# EAGLE design PIC32try2 (EAGLE 5.12)
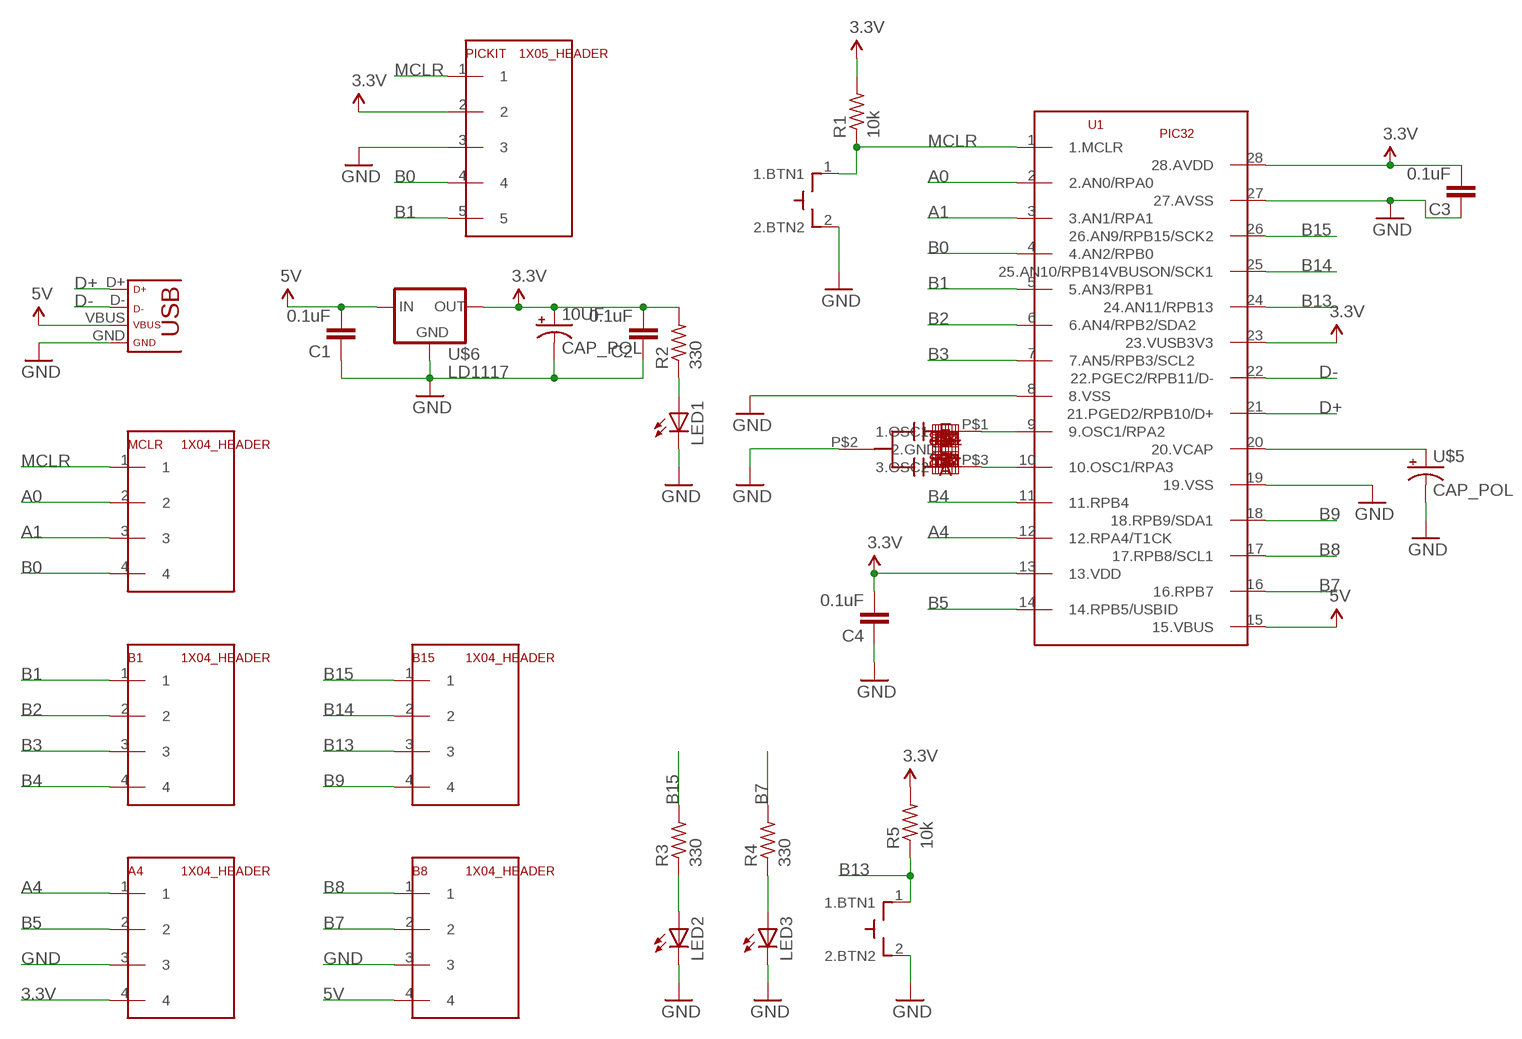
[diagram p0: schematic, sheet 1]

## Parts
8MHZ  CRYST2CRYST3  [CRYST2]
10UF  CAP_POL  [CAP_POL_D]
A4  1X04_HEADER  [1X04]
B1  1X04_HEADER  [1X04]
B8  1X04_HEADER  [1X04]
B15  1X04_HEADER  [1X04]
C1  0.1uF  C-EU025-025X050  [C025-025X050]
C2  0.1uF  C-EU025-025X050  [C025-025X050]
C3  0.1uF  C-EU025-025X050  [C025-025X050]
C4  0.1uF  C-EU025-025X050  [C025-025X050]
LED1  LED3MM  [LED3MM]
LED2  LED3MM  [LED3MM]
LED3  LED3MM  [LED3MM]
MCLR  1X04_HEADER  [1X04]
PICKIT  1X05_HEADER  [1X05]
R1  10k  R-US_0207/10  [0207/10]
R2  330  R-US_0207/10  [0207/10]
R3  330  R-US_0207/10  [0207/10]
R4  330  R-US_0207/10  [0207/10]
R5  10k  R-US_0207/10  [0207/10]
U1  PIC32  [DIL28-3]
U$4  PUSHBUTTON  [PB]
U$5  CAP_POL  [CAP_POL_D]
U$6  LD1117  [TO220]
U$9  USB  [USB-MINIB]
U$16  PUSHBUTTON  [PB]

## Nets
3.3V: 10UF.1(+) A4.4 C2.2 C3.2 C4.2 PICKIT.2 R1.2 R2.2 R5.2 U1.13(13.VDD) U1.23(23.VUSB3V3) U1.28(28.AVDD) U$6.2(OUT)
5V: B8.4 C1.2 U1.15(15.VBUS) U$6.3(IN) U$9.VBUS
A0: MCLR.2 U1.2(2.AN0/RPA0)
A1: MCLR.3 U1.3(3.AN1/RPA1)
A4: A4.1 U1.12(12.RPA4/T1CK)
B0: MCLR.4 PICKIT.4 U1.4(4.AN2/RPB0)
B1: B1.1 PICKIT.5 U1.5(5.AN3/RPB1)
B2: B1.2 U1.6(6.AN4/RPB2/SDA2)
B3: B1.3 U1.7(7.AN5/RPB3/SCL2)
B4: B1.4 U1.11(11.RPB4)
B5: A4.2 U1.14(14.RPB5/USBID)
B7: B8.2 R4.2 U1.16(16.RPB7)
B8: B8.1 U1.17(17.RPB8/SCL1)
B9: B15.4 U1.18(18.RPB9/SDA1)
B13: B15.3 R5.1 U1.24(24.AN11/RPB13) U$16.1(1.BTN1)
B14: B15.2 U1.25(25.AN10/RPB14VBUSON/SCK1)
B15: B15.1 R3.2 U1.26(26.AN9/RPB15/SCK2)
D+: U1.21(21.PGED2/RPB10/D+) U$9.D+
D-: U1.22(22.PGEC2/RPB11/D-) U$9.D-
GND: 8MHZ.P$2(2.GND) 10UF.2(-) A4.3 B8.3 C1.1 C2.1 C3.1 C4.1 LED1.K(C) LED2.K(C) LED3.K(C) PICKIT.3 U1.8(8.VSS) U1.19(19.VSS) U1.27(27.AVSS) U$4.2(2.BTN2) U$5.2(-) U$6.1(GND) U$9.GND U$16.2(2.BTN2)
MCLR: MCLR.1 PICKIT.1 R1.1 U1.1(1.MCLR) U$4.1(1.BTN1)
N$1: LED1.A R2.1
N$2: LED2.A R3.1
N$3: LED3.A R4.1
N$4: 8MHZ.P$1(1.OSC1) U1.9(9.OSC1/RPA2)
N$5: 8MHZ.P$3(3.OSC2) U1.10(10.OSC1/RPA3)
N$23: U1.20(20.VCAP) U$5.1(+)

## Library data of the parts
8MHZ = ME433:CRYST2
10UF U$5 = ME433:CAP_POL
A4 B1 B8 B15 MCLR = ME433:1X04_HEADER
C1-C4 = ME433:C-EU: CAPACITOR, European symbol
LED1-LED3 = led:LED: LED OSRAM: - CHIPLED LG R971, LG N971, LY N971, LG Q971, LY Q971, LO R971, LY R971 LH N974, LH R974 LS Q976, LO Q976, LY Q976 LO Q996 - Hyper CHIPLED LW Q18S LB Q993, LB Q99A, LB R99A - SideLED LS A670, LO A670, LY A670, LG A670, LP A670 LB A673, LV A673, LT A673, LW A673 LH A674 LY A675 LS A676, LA A676, LO A676, LY A676, LW A676 LS A679, LY A679, LG A679 - Hyper Micro SIDELED® LS Y876, LA Y876, LO Y876, LY Y876 LT Y87S - SmartLED LW L88C, LW L88S LB L89C, LB L89S, LG L890 LS L89K, LO L89K, LY L89K LS L896, LA L896, LO L896, LY L896 - TOPLED LS T670, LO T670, LY T670, LG T670, LP T670 LSG T670, LSP T670, LSY T670, LOP T670, LYG T670 LG T671, LOG T671, LSG T671 LB T673, LV T673, LT T673, LW T673 LH T674 LS T676, LA T676, LO T676, LY T676, LB T676, LH T676, LSB T676, LW T676 LB T67C, LV T67C, LT T67C, LS T67K, LO T67K, LY T67K, LW E67C LS E67B, LA E67B, LO E67B, LY E67B, LB E67C, LV E67C, LT E67C LW T67C LS T679, LY T679, LG T679 LS T770, LO T770, LY T770, LG T770, LP T770 LB T773, LV T773, LT T773, LW T773 LH T774 LS E675, LA E675, LY E675, LS T675 LS T776, LA T776, LO T776, LY T776, LB T776 LHGB T686 LT T68C, LB T68C - Hyper Mini TOPLED® LB M676 - Mini TOPLED Santana® LG M470 LS M47K, LO M47K, LY M47K Source: http://www.osram.convergy.de LUXEON: - LUMILED® LXK2-PW12-R00, LXK2-PW12-S00, LXK2-PW14-U00, LXK2-PW14-V00 LXK2-PM12-R00, LXK2-PM12-S00, LXK2-PM14-U00 LXK2-PE12-Q00, LXK2-PE12-R00, LXK2-PE12-S00, LXK2-PE14-T00, LXK2-PE14-U00 LXK2-PB12-K00, LXK2-PB12-L00, LXK2-PB12-M00, LXK2-PB14-N00, LXK2-PB14-P00, LXK2-PB14-Q00 LXK2-PR12-L00, LXK2-PR12-M00, LXK2-PR14-Q00, LXK2-PR14-R00 LXK2-PD12-Q00, LXK2-PD12-R00, LXK2-PD12-S00 LXK2-PH12-R00, LXK2-PH12-S00 LXK2-PL12-P00, LXK2-PL12-Q00, LXK2-PL12-R00 Source: www.luxeon.com KINGBRIGHT: KA-3528ASYC Source: www.kingbright.com
PICKIT = ME433:1X05_HEADER
R1-R5 = resistor:R-US_: RESISTOR, American symbol
U1 = ME433:PIC32
U$4 U$16 = ME433:PUSHBUTTON
U$6 = ME433:LD1117
U$9 = ME433:USB

## Board
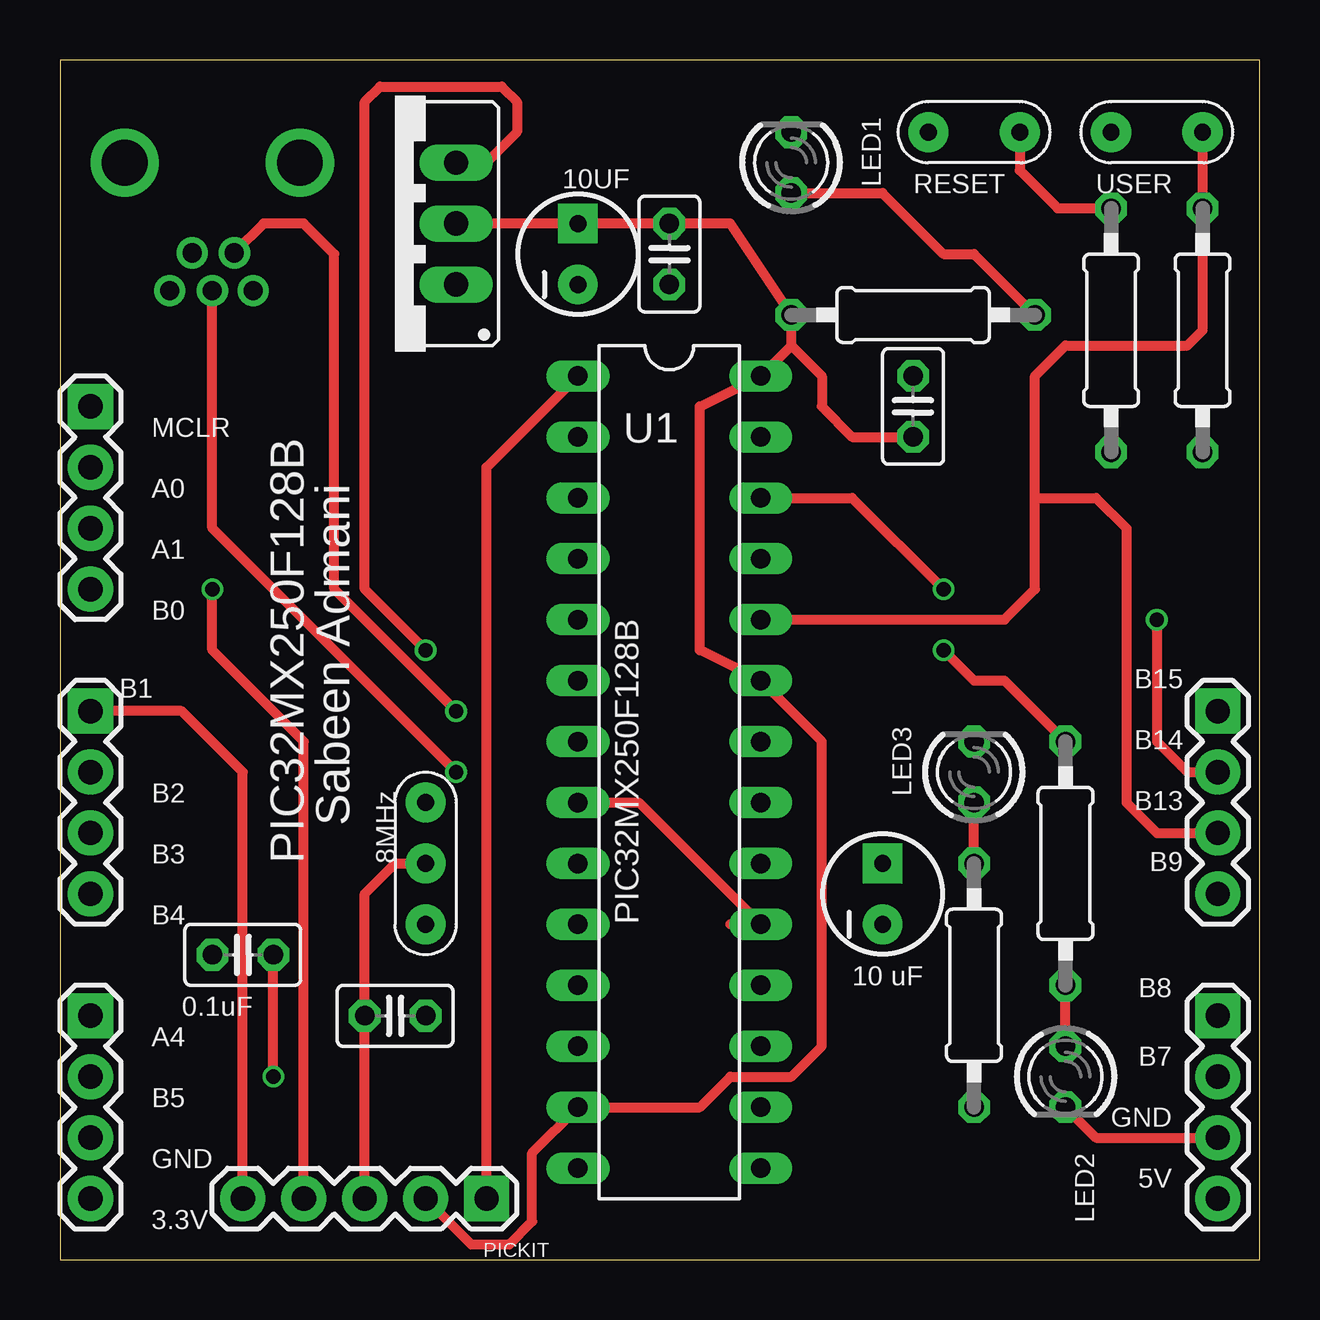
[diagram p1: board, top side]
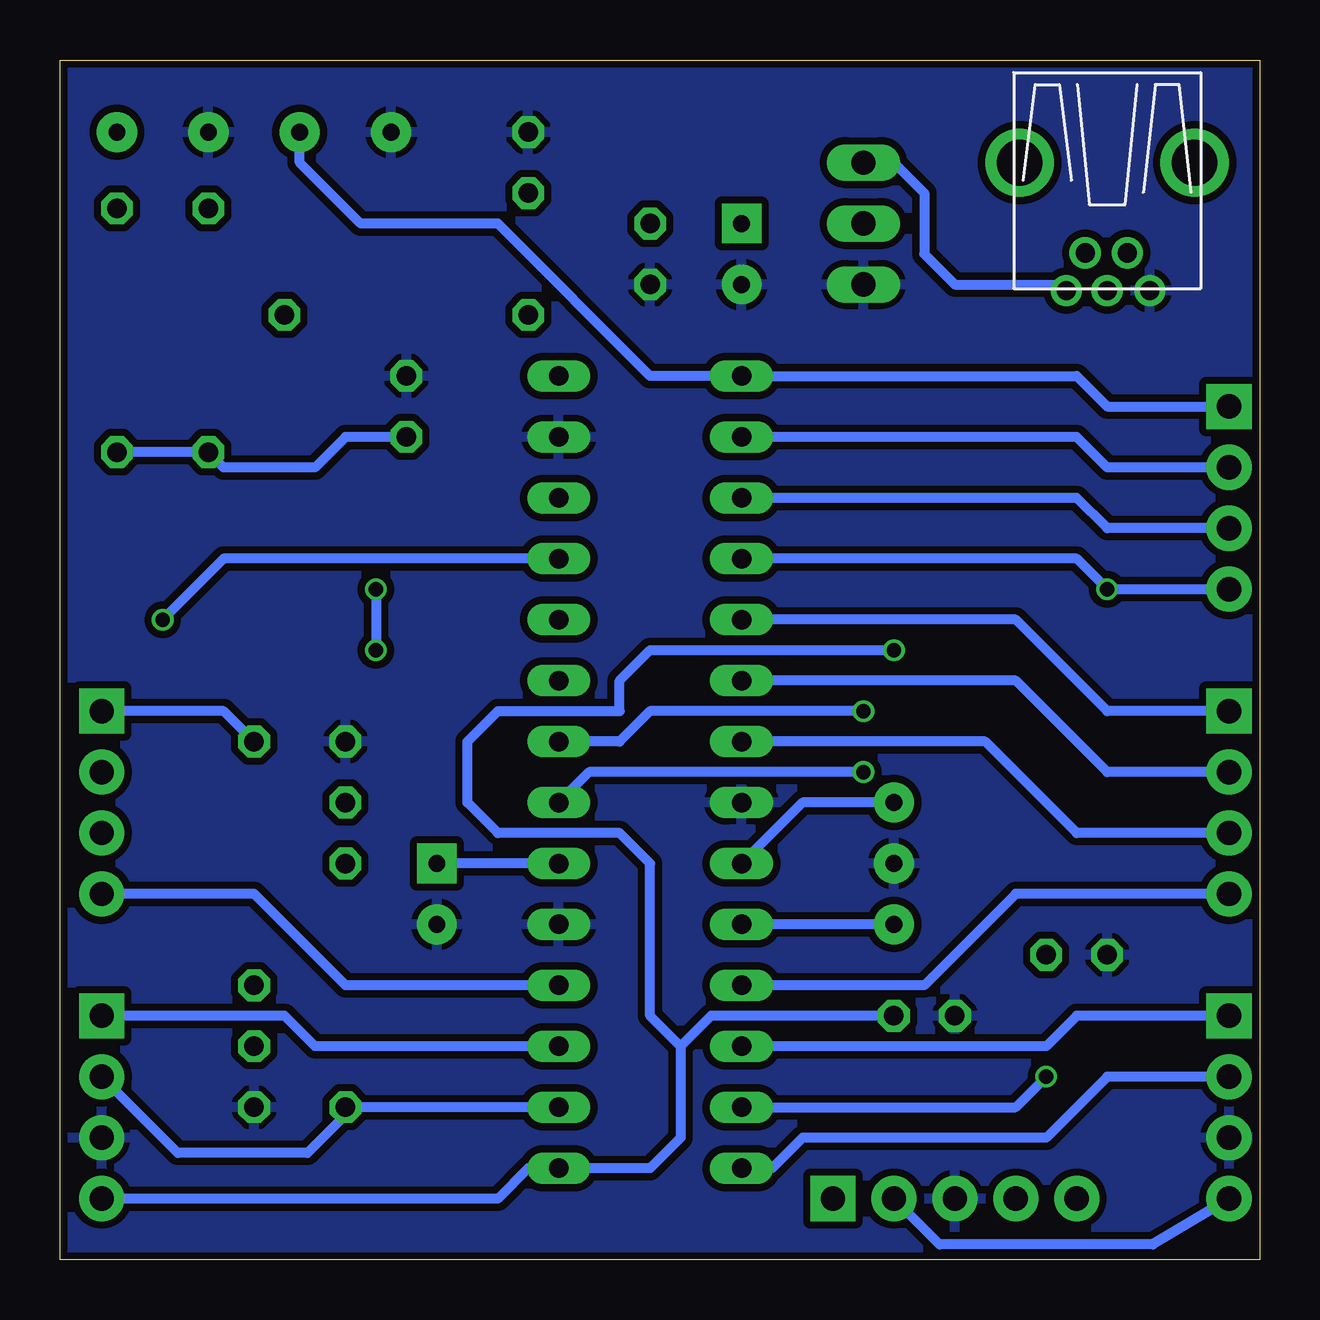
[diagram p2: board, bottom side, seen from below]

Size 50 x 50 mm. Coordinates in mm from the lower left corner, seen from the top.
Outline: 0,0 50,0 50,50 0,50 0,0
Copper layers (1*16): Top 0.035mm / dielectric 1.5mm / Bottom 0.035mm
Design rules "SeeedStudio_2layer_DRU_no_angle_20140221": minimum track width 6mil, minimum drill 12mil, track to track 6mil, track to pad 6mil, pad to pad 6mil, via to via 6mil, smd to smd 0mil, copper to edge 10mil, drill to drill 10mil, minimum pad ring 10mil, minimum via ring 6mil, stop-mask expansion 2mil, vias tented up to drill 100mil, thermal gap 10mil

### Footprints (pad centres in the part's own frame; a part is rotated, then mirrored left to right if it is on the bottom)
CRYST2 = drill 0.7 pad 1.676 round: P$1 -2.54,0; P$2 0,0; P$3 2.54,0
CAP_POL_D = drill 0.7 pad 1.651 square: 1 1.27,0 | drill 0.7 pad 1.651 round: 2 -1.27,0
1X04 = drill 1.016 pad 1.88 square: 1 0,0 | drill 1.016 pad 1.88 round: 2 2.54,0; 3 5.08,0; 4 7.62,0
C025-025X050 = drill 0.813 octagon: 1 -1.27,0; 2 1.27,0
LED3MM = drill 0.813 octagon: A -1.27,0; K 1.27,0
1X05 = drill 1.016 pad 1.88 square: 1 0,0 | drill 1.016 pad 1.88 round: 2 2.54,0; 3 5.08,0; 4 7.62,0; 5 10.16,0
0207/10 = drill 0.813 octagon: 1 -5.08,0; 2 5.08,0
DIL28-3 = drill 0.813 long: 1 -16.51,-3.81; 2 -13.97,-3.81; 3 -11.43,-3.81; 4 -8.89,-3.81; 5 -6.35,-3.81; 6 -3.81,-3.81; 7 -1.27,-3.81; 8 1.27,-3.81; 9 3.81,-3.81; 10 6.35,-3.81; 11 8.89,-3.81; 12 11.43,-3.81; 13 13.97,-3.81; 14 16.51,-3.81; 15 16.51,3.81; 16 13.97,3.81; 17 11.43,3.81; 18 8.89,3.81; 19 6.35,3.81; 20 3.81,3.81; 21 1.27,3.81; 22 -1.27,3.81; 23 -3.81,3.81; 24 -6.35,3.81; 25 -8.89,3.81; 26 -11.43,3.81; 27 -13.97,3.81; 28 -16.51,3.81
PB = drill 0.7 pad 1.676 round: 1 -1.905,0; 2 1.905,0
TO220 = drill 1.016 long: 1 -2.54,0; 2 0,0; 3 2.54,0
USB-MINIB = drill 0.8 round: D+ 4.064,0; D- 2.489,0.914; GND 4.064,-1.778; ID 2.489,-0.838; VBUS 4.064,1.702 | drill 1.9 round: P$6 -1.27,-3.65; P$7 -1.27,3.65

### Placement (x,y rotation side)
8MHZ  15.24,16.51 270 top
10UF  21.59,41.91 90 top
A4  1.27,10.16 270 top
B1  1.27,22.86 270 top
B8  48.26,10.16 270 top
B15  48.26,22.86 270 top
C1  13.97,10.16 0 top
C2  25.4,41.91 90 top
C3  35.56,35.56 270 top
C4  7.62,12.7 0 top
LED1  30.48,45.72 90 top
LED2  41.91,7.62 270 top
LED3  38.1,20.32 90 top
MCLR  1.27,35.56 270 top
PICKIT  17.78,2.54 180 top
R1  43.81,38.73 270 top
R2  35.56,39.37 180 top
R3  41.91,16.51 90 top
R4  38.1,11.43 270 top
R5  47.62,38.73 270 top
U1  25.4,20.32 270 top
U$4  38.1,46.99 180 top
U$5  34.29,15.24 90 top
U$6  16.51,43.18 90 top
U$9  6.35,44.45 270 top
U$16  45.72,46.99 180 top

### Tracks (layer width: path | path; a pad name or v marks a point on that pad's centre or on a via)
3.3V  (via drill 0.6)
  Top 0.406: U$6.2 10UF.1 C2.2 27.94,43.18 R2.2 30.48,38.1 | 30.48,38.1 U1.28 26.67,35.56 26.67,25.4 U1.23 31.75,21.59 31.75,8.89 30.48,7.62 27.94,7.62 26.67,6.35 U1.13 19.68,4.45 19.68,1.59 18.73,0.64 17.14,0.64 PICKIT.2 | 30.48,38.1 31.75,36.83 31.75,35.56 33.02,34.29 C3.2 | v8.89,7.62 C4.2
  Bottom 0.406: R5.2 R1.2 43.18,33.02 39.37,33.02 38.1,34.29 C3.2 | A4.4 4.45,0.64 13.34,0.64 PICKIT.2 | v8.89,7.62 10.16,6.35 U1.13
5V  (via drill 0.6)
  Top 0.406: v15.24,25.4 12.7,27.94 12.7,48.26 13.34,48.9 18.41,48.9 19.05,48.26 19.05,46.99 17.78,45.72 U$6.3
  Bottom 0.406: B8.4 31.75,2.54 30.48,3.81 U1.15 25.4,3.81 24.13,5.08 24.13,8.89 | U$6.3 15.24,45.72 13.97,44.45 13.97,41.91 12.7,40.64 8.31,40.64 U$9.VBUS | 24.13,8.89 22.86,10.16 C1.2 | 24.13,8.89 25.4,10.16 25.4,16.51 26.67,17.78 31.75,17.78 33.02,19.05 33.02,21.59 31.75,22.86 26.67,22.86 26.67,24.13 25.4,25.4 v15.24,25.4
A0
  Bottom 0.406: MCLR.2 6.35,33.02 7.62,34.29 U1.2
A1
  Bottom 0.406: MCLR.3 6.35,30.48 7.62,31.75 U1.3
A4
  Bottom 0.406: A4.1 7.62,10.16 8.89,8.89 U1.12
B0  (via drill 0.6)
  Top 0.406: v6.35,27.94 6.35,25.4 10.16,21.59 PICKIT.4
  Bottom 0.406: MCLR.4 v6.35,27.94 7.62,29.21 U1.4
B1
  Top 0.406: PICKIT.5 7.62,20.32 5.08,22.86 B1.1
  Bottom 0.406: B1.1 6.35,22.86 10.16,26.67 U1.5
B2
  Bottom 0.406: B1.2 6.35,20.32 10.16,24.13 U1.6
B3
  Bottom 0.406: B1.3 7.62,17.78 11.43,21.59 U1.7
B4
  Bottom 0.406: B1.4 10.16,15.24 13.97,11.43 U1.11
B5
  Bottom 0.406: A4.2 6.35,7.62 8.89,5.08 19.05,5.08 20.32,3.81 U1.14
B7
  Bottom 0.406: U1.16 R4.2 38.1,6.03 39.69,4.45 45.09,4.45 B8.2
B8
  Bottom 0.406: U1.17 39.37,8.89 40.64,10.16 B8.1
B9
  Bottom 0.406: U1.18 38.1,11.43 41.91,15.24 B15.4
B13
  Top 0.406: U$16.1 R5.1 47.62,38.73 46.99,38.1 41.91,38.1 40.64,36.83 40.64,31.75 | U1.24 39.37,26.67 40.64,27.94 40.64,31.75 | B15.3 45.72,17.78 44.45,19.05 44.45,30.48 43.18,31.75 40.64,31.75
B14  (via drill 0.6)
  Top 0.406: v45.72,26.67 45.72,21.59 46.99,20.32 B15.2
  Bottom 0.406: U1.25 43.18,29.21 v45.72,26.67
B15  (via drill 0.6)
  Top 0.406: U1.26 33.02,31.75 v36.83,27.94 | v36.83,25.4 38.1,24.13 39.37,24.13 R3.2
  Bottom 0.406: R3.2 43.18,22.86 B15.1 | v36.83,27.94 v36.83,25.4
D+  (via drill 0.6)
  Top 0.406: U$9.D+ 6.35,30.48 v16.51,20.32
  Bottom 0.406: v16.51,20.32 27.94,20.32 U1.21
D-  (via drill 0.6)
  Top 0.406: v16.51,22.86 11.43,27.94 11.43,41.91 10.16,43.18 8.48,43.18 U$9.D-
  Bottom 0.406: v16.51,22.86 25.4,22.86 26.67,21.59 U1.22
GND
  Top 0.406: LED2.K 43.18,5.08 B8.3 | 8MHZ.P$2 13.97,16.51 12.7,15.24 C1.1 PICKIT.3 | 27.94,13.97 U1.19 24.13,19.05 U1.8
  pour Bottom (isolate 0.305): 0,0 49.53,0 49.53,49.53 0,49.53
MCLR
  Top 0.406: U$4.1 40.01,45.4 41.59,43.81 R1.1 | PICKIT.1 17.78,33.02 U1.1
  Bottom 0.406: MCLR.1 6.35,35.56 7.62,36.83 U1.1 25.4,36.83 31.75,43.18 37.47,43.18 40.01,45.72 U$4.1
N$1
  Top 0.406: LED1.A 34.29,44.45 36.83,41.91 38.1,41.91 R2.1
N$2
  Top 0.406: LED2.A R3.1
N$3
  Top 0.406: R4.1 LED3.A
N$4
  Bottom 0.406: 8MHZ.P$1 19.05,19.05 U1.9
N$5
  Bottom 0.406: 8MHZ.P$3 U1.10
N$23
  Bottom 0.406: U1.20 U$5.1

### Text on the board
tPlace: RESET | USER | MCLR | A0 | A1 | B0 | B15 | B14 | B2 | B13 | Sabeen Admani | B3 | PIC32MX250F128B | 8MHz | B9 | B4 | PIC32MX250F128B | B8 | 10 uF | 0.1uF | A4 | B7 | B5 | GND | GND | 5V | 3.3V